# EasyEDA Pro project ProPrj_Piano_scan_for_conserts3_2026-02-26.epro, schematic all
Board Name: all; Create Date: 2026-01-01; Page Name: a; Project Name: Piano_scan_for_conserts3; Schematic Name: all; Update Date: 2026-01-01; Company: EasyEDA.com; Page Size: A4; Version: V1.0
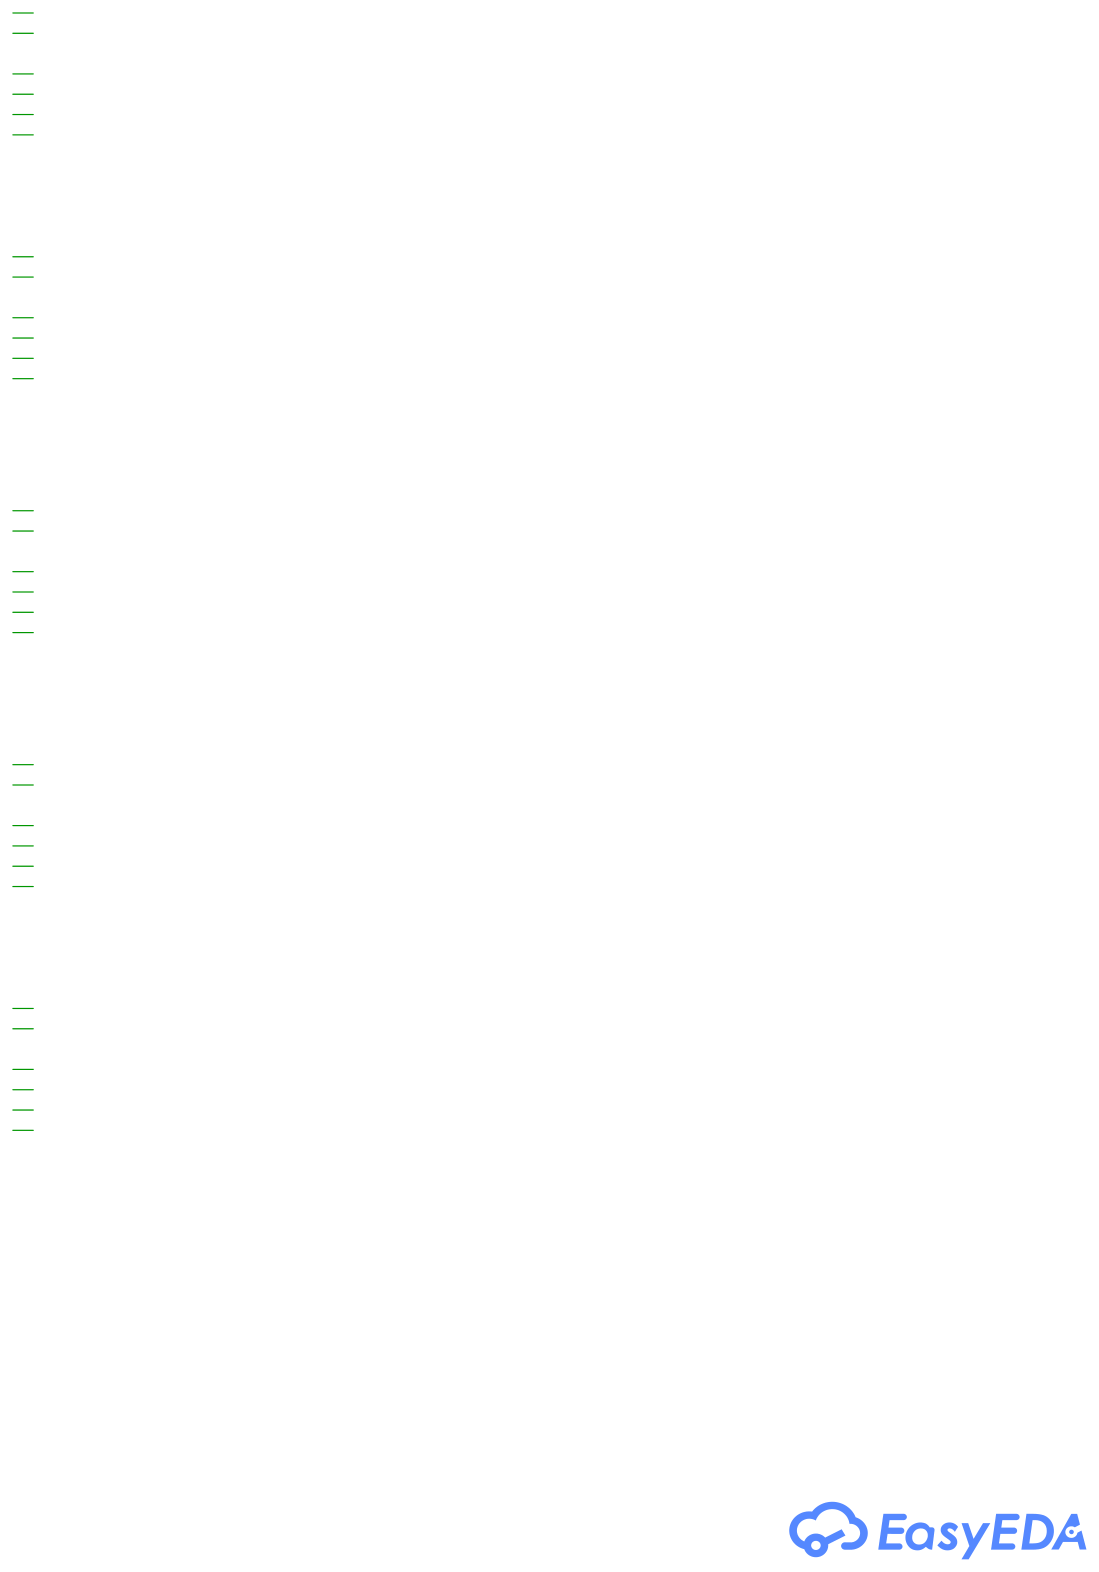
[diagram p5: schematic sheet]

## Parts
CBB1  -
CBB2  -
CBB3  -
CBB4  -
CBB5  -
CBB6  -
CBB7  -
CBB8  -
CBB9  -
CBB10  -
CBB11  -

## Library data of the parts
CBB1 CBB4 CBB6 CBB8 = -: Batch Reuse: [1,3]

## Nets
Net-(CBB1-): CBB1.(TIM_TRIGG) CBB2.(TIM_TRIGG)
Net-(CBB4-): CBB4.(TIM_TRIGG) CBB5.(TIM_TRIGG)
Net-(CBB6-): CBB6.(TIM_TRIGG) CBB7.(TIM_TRIGG)
Net-(CBB8-): CBB8.(TIM_TRIGG) CBB9.(TIM_TRIGG)
Net-(CBB10-): CBB10.(TIM_TRIGG) CBB11.(TIM_TRIGG)
